# Altium schematic sheet Sheet1.SchDoc
size A
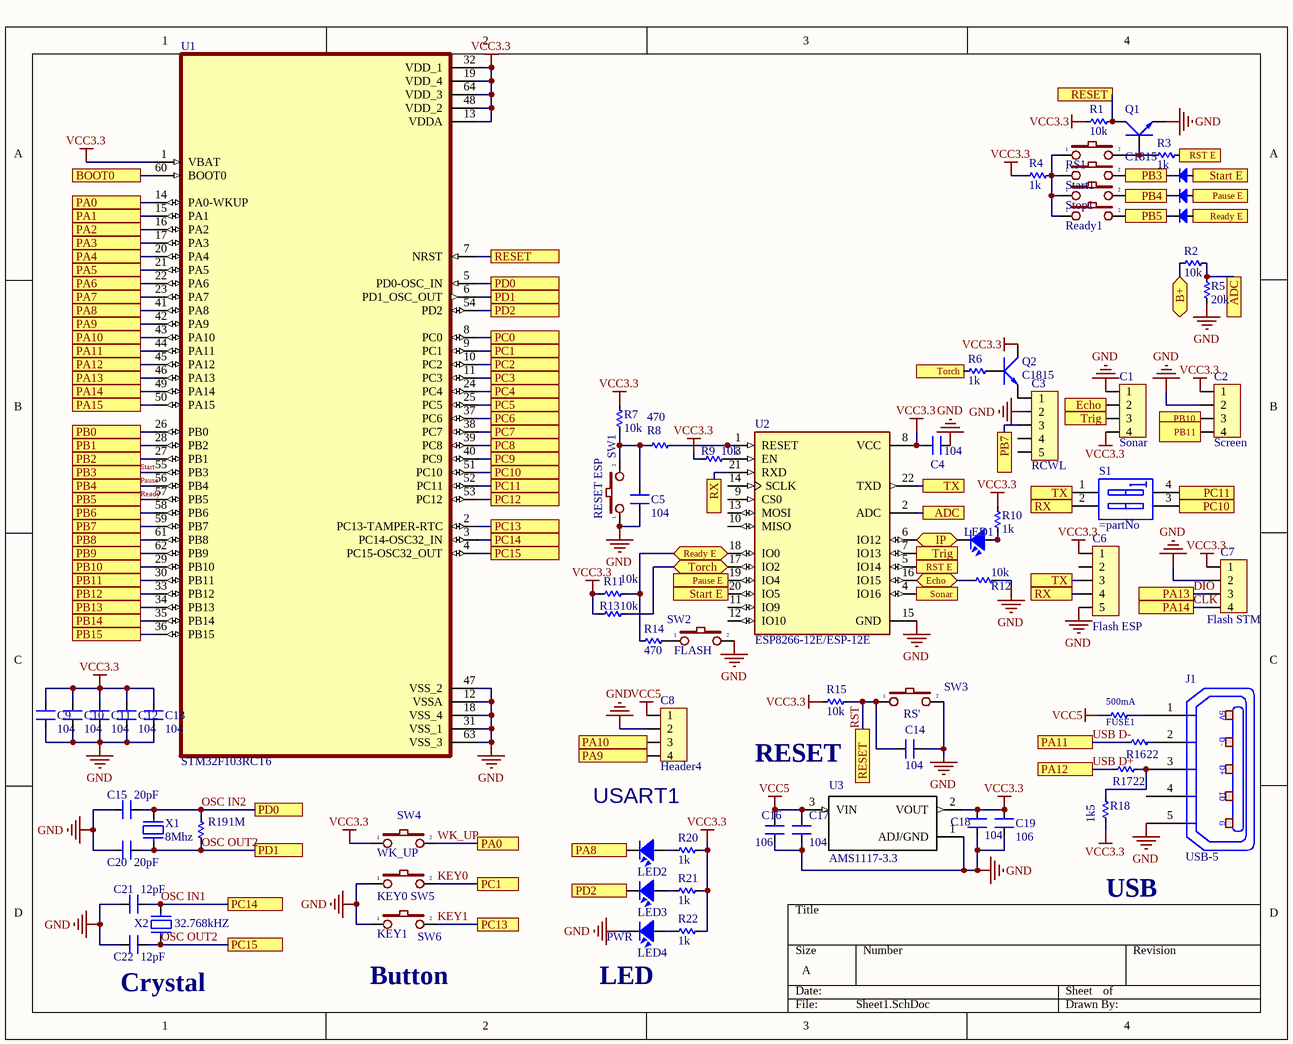
[diagram p0: Sheet1.SchDoc]

## Parts
C1  Sonar  [HDR4]
C2  Screen  [HDR4]
C3  RCWL  [HDR5]
C4  104  [SM-CAP-0805]
C5  104  [SM-CAP-0805]
C6  Flash ESP  [HDR5]
C7  Flash STM  [HDR4]
C8  Header4  [HDR4]
C9  104  [SM-CAP-0805]
C10  104  [SM-CAP-0805]
C11  104  [SM-CAP-0805]
C12  104  [SM-CAP-0805]
C13  104  [SM-CAP-0805]
C14  104  [SM-CAP-0805]
C15  20pF  [SM-CAP-0805]
C16  106  [SM-CAP-0805]
C17  104  [SM-CAP-0805]
C18  104  [SM-CAP-0805]
C19  106  [SM-CAP-0805]
C20  20pF  [SM-CAP-0805]
C21  12pF  [SM-CAP-0805]
C22  12pF  [SM-CAP-0805]
DIO1  Diode SMD  [DIO-SMD-106]  (value not drawn)
DIO2  Diode SMD  [DIO-SMD-106]  (value not drawn)
DIO3  Diode SMD  [DIO-SMD-106]  (value not drawn)
FUSE1  500mA  [RES-SMD-0805]
J1  USB-5  [USB-M1]
LED1  DS0  [LED-0805-Blue]  (value not drawn)
LED2  DS0  [LED-0805-Blue]  (value not drawn)
LED3  DS1  [LED-0805-Blue]  (value not drawn)
LED4  PWR  [LED-0805-Blue]
Q1  C1815  [SOT23B]
Q2  C1815  [SOT23B]
R1  10k  [RES-SMD-0805]
R2  10k  [RES-SMD-0805]
R3  1k  [RES-SMD-0805]
R4  1k  [RES-SMD-0805]
R5  20k  [RES-SMD-0805]
R6  1k  [RES-SMD-0805]
R7  10k  [RES-SMD-0805]
R8  470  [RES-SMD-0805]
R9  10k  [RES-SMD-0805]
R10  1k  [RES-SMD-0805]
R11  10k  [RES-SMD-0805]
R12  10k  [RES-SMD-0805]
R13  10k  [RES-SMD-0805]
R14  470  [RES-SMD-0805]
R15  10k  [RES-SMD-0805]
R16  22  [RES-SMD-0805]
R17  22  [RES-SMD-0805]
R18  1k5  [RES-SMD-0805]
R19  1M  [RES-SMD-0805]
R20  1k  [RES-SMD-0805]
R21  1k  [RES-SMD-0805]
R22  1k  [RES-SMD-0805]
Ready1  SW  [SW1-SMD]  (value not drawn)
RS1  SW  [SW1-SMD]  (value not drawn)
S1  (no value)  [SW-DIP2]
Start1  SW  [SW1-SMD]  (value not drawn)
Stop1  SW  [SW1-SMD]  (value not drawn)
SW1  RESET ESP  [SW1-SMD]
SW2  FLASH  [SW1-SMD]
SW3  RS'  [SW1-SMD]
SW4  WK_UP  [SW1-SMD]
SW5  KEY0  [SW1-SMD]
SW6  KEY1  [SW1-SMD]
U1  STM32F103RCT6  [QFP50P1200X1200X160-64N]
U2  ESP8266-12E/ESP-12E  [XCVR_ESP8266-12E/ESP-12E]
U3  AMS1117-3.3  [*SOT229P700X180-4N]
X1  8Mhz  [XT2]
X2  32.768kHZ  [XT32k]

## Ports
ADC, B+ (bidir), BOOT0, Echo, Echo (bidir), IP (bidir), PA0, PA1, PA2, PA3, PA4, PA5, PA6, PA7, PA8, PA9, PA10, PA11, PA12, PA13, PA14, PA15, Pause E, PB0, PB1, PB2, PB3, PB4, PB5, PB6, PB7, PB8, PB9, PB10, PB11, PB12, PB13, PB14, PB15, PC0, PC1, PC2, PC3, PC4, PC5, PC6, PC7, PC8, PC9, PC10, PC11, PC12, PC13, PC14, PC15, PD0, PD1, PD2, Ready E, Ready E (bidir), RESET, RST E, RX, Sonar, Start E, Torch, Torch (bidir), Trig, TX

## Nets
GND: C1.1 C2.2 C3.2 C4.1 C5.1 C6.5 C7.2 C8.2 C9.1 C10.1 C11.1 C12.1 C13.1 C14.1 C15.1 C16.1 C17.1 C18.1 C19.1 C20.1 C21.1 C22.1 J1.5(P5) LED4.2 Q1.1(E) R5.2 R12.2 SW1.1 SW2.2 SW3.2 SW5.1 SW6.1 U1.12(VSSA) U1.18(VSS_4) U1.31(VSS_1) U1.47(VSS_2) U1.63(VSS_3) U2.15(GND) U3.1(ADJ/GND)
VCC3.3: C1.4 C2.1 C4.2 C6.1 C7.1 C9.2 C10.2 C11.2 C12.2 C13.2 C18.2 C19.2 Q2.2(C) R1.1 R4.2 R7.1 R9.1 R10.1 R11.1 R13.1 R15.2 R18.1 R20.1 R21.1 R22.1 SW4.1 U1.1(VBAT) U1.13(VDDA) U1.19(VDD_4) U1.32(VDD_1) U1.48(VDD_2) U1.64(VDD_3) U2.8(VCC) U3.2(VOUT)
VCC5: C8.1 C16.2 C17.2 FUSE1.1 U3.3(VIN)
ADC: R2.2 R5.1 U2.2(ADC) ; port ADC
B+: R2.1 ; port B+
BOOT0: U1.60(BOOT0) ; port BOOT0
CLK: C7.4 U1.49(PA14) ; port PA14
DIO: C7.3 U1.46(PA13) ; port PA13
Echo: C1.2 R12.1 U2.16(IO15) ; port Echo
IP: LED1.2 U2.6(IO12) ; port IP
KEY0: SW5.2 U1.9(PC1) ; port PC1
KEY1: SW6.2 U1.2(PC13-TAMPER-RTC) ; port PC13
OSC IN1: C21.2 U1.3(PC14-OSC32_IN) X2.2 ; port PC14
OSC IN2: C15.2 R19.1 U1.5(PD0-OSC_IN) X1.1 ; port PD0
OSC OUT2: C20.2 C22.2 R19.2 U1.4(PC15-OSC32_OUT) U1.6(PD1_OSC_OUT) X1.2 X2.1 ; port PD1, port PC15
PA1: U1.15(PA1) ; port PA1
PA2: U1.16(PA2) ; port PA2
PA3: U1.17(PA3) ; port PA3
PA4: U1.20(PA4) ; port PA4
PA5: U1.21(PA5) ; port PA5
PA6: U1.22(PA6) ; port PA6
PA7: U1.23(PA7) ; port PA7
PA8: LED2.2 U1.41(PA8) ; port PA8
PA9: C8.4 U1.42(PA9) ; port PA9
PA10: C8.3 U1.43(PA10) ; port PA10
PA15: U1.50(PA15) ; port PA15
Pause: DIO2.2(K) Stop1.2 U1.56(PB4) ; port PB4
Pause E: DIO2.1(A) U2.19(IO4) ; port Pause E
PB0: U1.26(PB0) ; port PB0
PB1: U1.28(PB2) ; port PB1
PB2: U1.27(PB1) ; port PB2
PB6: U1.58(PB6) ; port PB6
PB7: C3.3 U1.59(PB7) ; port PB7
PB8: U1.61(PB8) ; port PB8
PB9: U1.62(PB9) ; port PB9
PB10: C2.3 U1.29(PB10) ; port PB10
PB11: C2.4 U1.30(PB11) ; port PB11
PB12: U1.33(PB12) ; port PB12
PB13: U1.34(PB13) ; port PB13
PB14: U1.35(PB14) ; port PB14
PB15: U1.36(PB15) ; port PB15
PC0: U1.8(PC0) ; port PC0
PC2: U1.10(PC2) ; port PC2
PC3: U1.11(PC3) ; port PC3
PC4: U1.24(PC4) ; port PC4
PC5: U1.25(PC5) ; port PC5
PC6: U1.37(PC6) ; port PC6
PC7: U1.38(PC7) ; port PC7
PC8: U1.39(PC8) ; port PC8
PC9: U1.40(PC9) ; port PC9
PC10: S1.3 U1.51(PC10) ; port PC10
PC11: S1.4 U1.52(PC11) ; port PC11
PC12: U1.53(PC12) ; port PC12
PD2: LED3.2 U1.54(PD2) ; port PD2
Ready: DIO3.2(K) Ready1.2 U1.57(PB5) ; port PB5
Ready E: DIO3.1(A) R11.2 R14.2 U2.18(IO0) ; port Ready E
RST: C14.2 Q1.2(C) R1.2 R15.1 SW3.1 U1.7(NRST) ; port RESET
RST E: R3.1 U2.5(IO14) ; port RST E
RX: C6.4 S1.2 U2.21(RXD) ; port RX
Sonar: U2.4(IO16) ; port Sonar
Start: DIO1.2(K) Start1.2 U1.55(PB3) ; port PB3
Start E: DIO1.1(A) U2.20(IO5) ; port Start E
Torch: R6.1 R13.2 U2.17(IO2) ; port Torch
Trig: C1.3 U2.7(IO13) ; port Trig
TX: C6.3 S1.1 U2.22(TXD) ; port TX
USB D+: R17.1 U1.45(PA12) ; port PA12
USB D-: R16.1 U1.44(PA11) ; port PA11
WK_UP: SW4.2 U1.14(PA0-WKUP) ; port PA0
NetC3_1: C3.1 Q2.1(E)
NetC5_2: C5.2 R7.2 R8.2 SW1.2
NetFUSE1_2: FUSE1.2 J1.1(P1)
NetJ1_2: J1.2(P2) R16.2
NetJ1_3: J1.3(P3) R17.2 R18.2
NetLED1_1: LED1.1 R10.2
NetLED2_1: LED2.1 R20.2
NetLED3_1: LED3.1 R21.2
NetLED4_1: LED4.1 R22.2
NetQ1_3: Q1.3(B) R3.2 RS1.2
NetQ2_3: Q2.3(B) R6.2
NetR4_1: R4.1 Ready1.1 RS1.1 Start1.1 Stop1.1
NetR8_1: R8.1 U2.1(RESET)
NetR9_2: R9.2 U2.3(EN)
NetR14_1: R14.1 SW2.1

Not connected (* = marked no-connect by the designer): C3 4 5; C6 2; J1 4(P4); U2 9(CS0) 10(MISO) 11(IO9) 12(IO10) 13(MOSI) 14(SCLK)

## Notes on the sheet
- RESET
- USART1
- USB
- Crystal
- (near SW6) Button
- LED
- (in symbol USB-5) 5V; D-; D+; ID; G

## Library data of the parts
C1 C2 C7 C8 = Header4: Header IDC, 4 x 1 Pin Vertical 2.54mm Pitch (Non-Boxed, Male); Manufacturer: W¨¹rth Elektronik eiSos GmbH; partNo: 613002143121; ComponentLink1 Description: Manufacturer; ComponentLink2 Description: Datasheet; NoPins: 02; Created Date: 29 March 2013; ComponentLink1URL: http://www.we-online.com; ComponentLink2URL: http://katalog.we-online.de/em/datasheet/6130xx143121.pdf; Created by: Karrer Zheng
C3 C6 = Header5: Header IDC, 5 x 1 Pin Vertical 2.54mm Pitch (Non-Boxed, Male); Manufacturer: W¨¹rth Elektronik eiSos GmbH; partNo: 613002143121; ComponentLink1 Description: Manufacturer; ComponentLink2 Description: Datasheet; NoPins: 02; Created Date: 29 March 2013; ComponentLink1URL: http://www.we-online.com; ComponentLink2URL: http://katalog.we-online.de/em/datasheet/6130xx143121.pdf; Created by: Karrer Zheng
C4 C5 C9-C22 = CN: Value: 0,1uF/300V; Designed by: VanDungEvn
DIO1-DIO3 = Diode SMD: Default Diode; Code - JEDEC: DO-214-AB; Value: 1N5007; Published: 8-Jun-2000; Revision: July-2002: Re-released for DXP Platform.; Publisher: Altium Limited
FUSE1 R1-R22 = Res-SMD: Resistor; Manufacturer: Generic Components; Class: Passive; Published: 08/06/2000; Publisher: Altium Hobart Technology Centre
J1 = USB-5: Manufacturer: FCI; Manufacturer Part Number: 10118193-0001LF; Connector Type: USB - micro B; Number of Contacts: 5; Gender: Receptacle; Specifications: USB 2.0; .Creator: MM; .Checked PCB: RF; Supplier 1: Digi-Key; RoHS: RoHS Compliant; Category: Connectors, Interconnects; Stock 1: 28642; Pricing 1: 1=0.46, 10=0.433, 25=0.3712, 50=0.3156, 100=0.3032, 250=0.27224, 500=0.25988 (USD); Packaging: Cut Tape (CT); Mounting Type: Surface Mount, Right Angle, Horizontal; Features: Shielded, Solder Retention; Ingress Protection: -; ComponentLink1URL: http://portal.fciconnect.com/Comergent//fci/drawing/10118193.pdf; ComponentLink1Description: http://portal.fciconnect.com/Comergent//fci/drawing/10118193.pdf; Supplier Part Number 1: 609-4616-1-ND; .Checked SCH: MM
LED1-LED4 = LED SMD: Value: LED 3 - 5 ly 2 Colour
Q1 Q2 = C1815: NPN 600mW, ECB; Value: C1815
Ready1 RS1 Start1 Stop1 SW1-SW6 = SW2: Switch button 2 pin; Value: SW chip 2 pin
S1 = SWDIP2: WS-DITV 2.54 mm small compact THT flat actuator with top tape; Manufacturer: Wurth Elektronik; Part No.: 418127160902; ComponentLink1 Description: Manufacturer; ComponentLink2 Description: Datasheet; Pole: 02; Created Date: Dec.2015; ComponentLink1URL: http://www.we-online.com; ComponentLink2URL: http://katalog.we-online.de/em/datasheet/4181271609xx.pdf; Created by: Baojun Chen
U1 = STM32F103RCT6: ARMÂ® CortexÂ®-M3 STM32F1 Microcontroller IC 32-Bit 72MHz 256KB _256K x 8_ FLASH; MF: STMicroelectronics; MP: STM32F103RCT6; Price: None; Package: LQFP-64 STMicroelectronics; Availability: Unavailable; SnapEDA_Link: https://www.snapeda.com/parts/STM32F103RCT6/STMicroelectronics/view-part/44152/?ref=snap; Value: *
U2 = ESP8266-12E/ESP-12E: This WiFi module has a 32-bit MCU micro and clock speeds supporting 80 MHz or 160 MHz. Supports the RTOS and integrated Wi-Fi MAC/BB/RF/PA/LNA, and has an on-board antenna.; MF: AI-Thinker; Price: None; Package: None; Value: *; MP: ESP8266-12E/ESP-12E; Availability: Unavailable; SnapEDA_Link: https://www.snapeda.com/parts/ESP8266-12E/ESP-12E/AI-Thinker/view-part/106414/?ref=snap
U3 = AMS1117-3.3: Sot223/Pkg 1-Amp 3.3-Volt Low Drop Out Voltage Regulatator; MF: Advanced Monolithic Systems; Price: None; MP: AMS1117-3.3; SnapEDA_Link: https://www.snapeda.com/parts/AMS1117-3.3/Advanced%20Monolithic%20Systems/view-part/53450/?ref=snap; Availability: Unavailable; Package: None; Value: *
X1 = XT2: Crystal For all Crystal 2pin.; Value: 4Mhz
X2 = XT2: Crystal, 32.768 KHz, -40 to 85 degC, 3.2 x 1.5 x 0.9 mm SMD; Value: 4Mhz